# EAGLE schematic eight_slider_breakout (EAGLE 7.6.0)
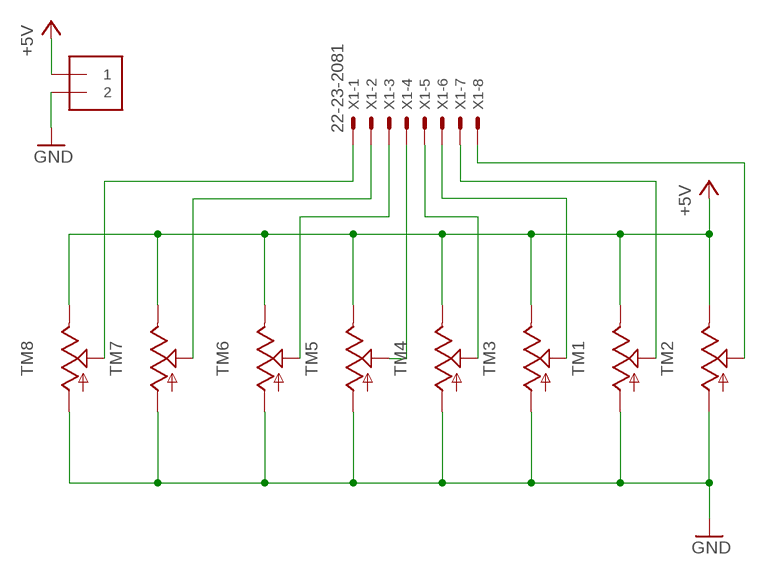
[diagram p0: schematic, sheet 1]

## Parts
J1  1X2-3.5MM  [1X2-3.5MM]
TM1  TRIMSLIDE60  [SLIDEPOT-60]
TM2  TRIMSLIDE60  [SLIDEPOT-60]
TM3  TRIMSLIDE60  [SLIDEPOT-60]
TM4  TRIMSLIDE60  [SLIDEPOT-60]
TM5  TRIMSLIDE60  [SLIDEPOT-60]
TM6  TRIMSLIDE60  [SLIDEPOT-60]
TM7  TRIMSLIDE60  [SLIDEPOT-60]
TM8  TRIMSLIDE60  [SLIDEPOT-60]
X1  22-23-2081  [22-23-2081]

## Nets
+5V: J1.1 TM1.B TM2.B TM3.B TM4.B TM5.B TM6.B TM7.B TM8.B
GND: J1.2 TM1.A TM2.A TM3.A TM4.A TM5.A TM6.A TM7.A TM8.A
N$1: TM8.WIPER X1.1
N$2: TM7.WIPER X1.2
N$3: TM6.WIPER X1.3
N$4: TM5.WIPER X1.4
N$5: TM4.WIPER X1.5
N$6: TM3.WIPER X1.6
N$7: TM1.WIPER X1.7
N$8: TM2.WIPER X1.8

## Library data of the parts
J1 = adafruit:1X2: 3.5mm Terminal block http://www.ladyada.net/library/pcb/eaglelibrary.html
TM1-TM8 = stefan-lochbrunner_EAGLE_master_custom libraries_potentiometers_Bourns PTA series_Bourns PTA series:TRIM: Sliding potentiometers Based on Adafruits (https://github.com/adafruit/Adafruit-Eagle-Library) 'TRIM' device. For Bourns PTA series and TT Electronics PSxx series potentiometers.
X1 = con-molex:22-23-2081: .100" (2.54mm) Center Header - 8 Pin; MF: MOLEX; MPN: 22-23-2081; OC_FARNELL: 1756826; OC_NEWARK: 01C7592